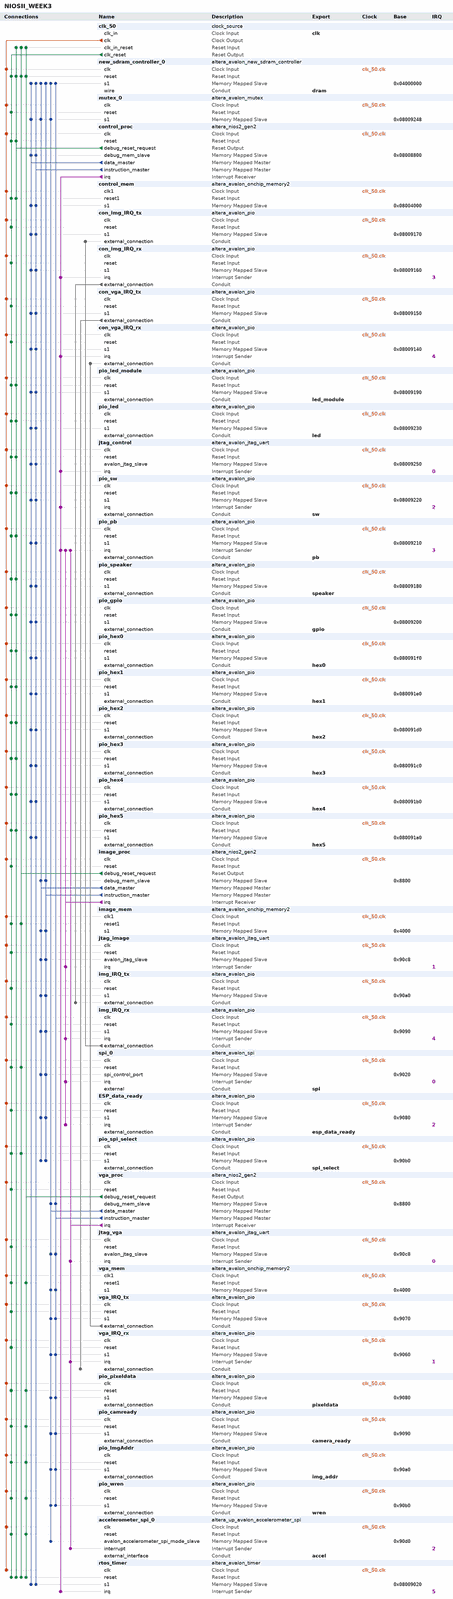
[diagram p0: system contents, whole]
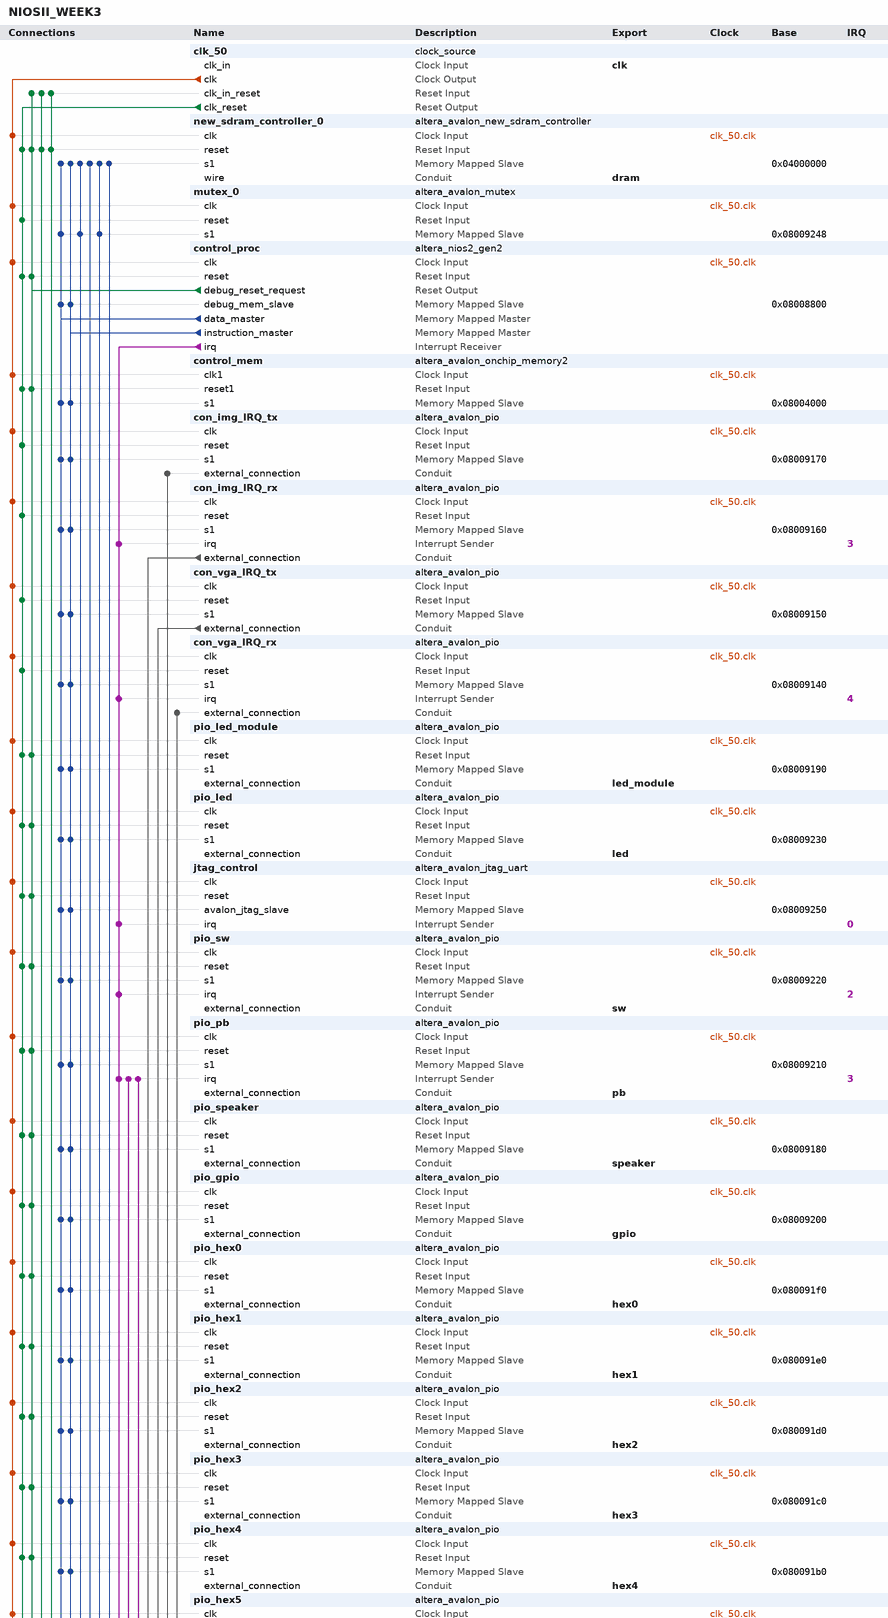
[diagram p1: system contents, upper part]
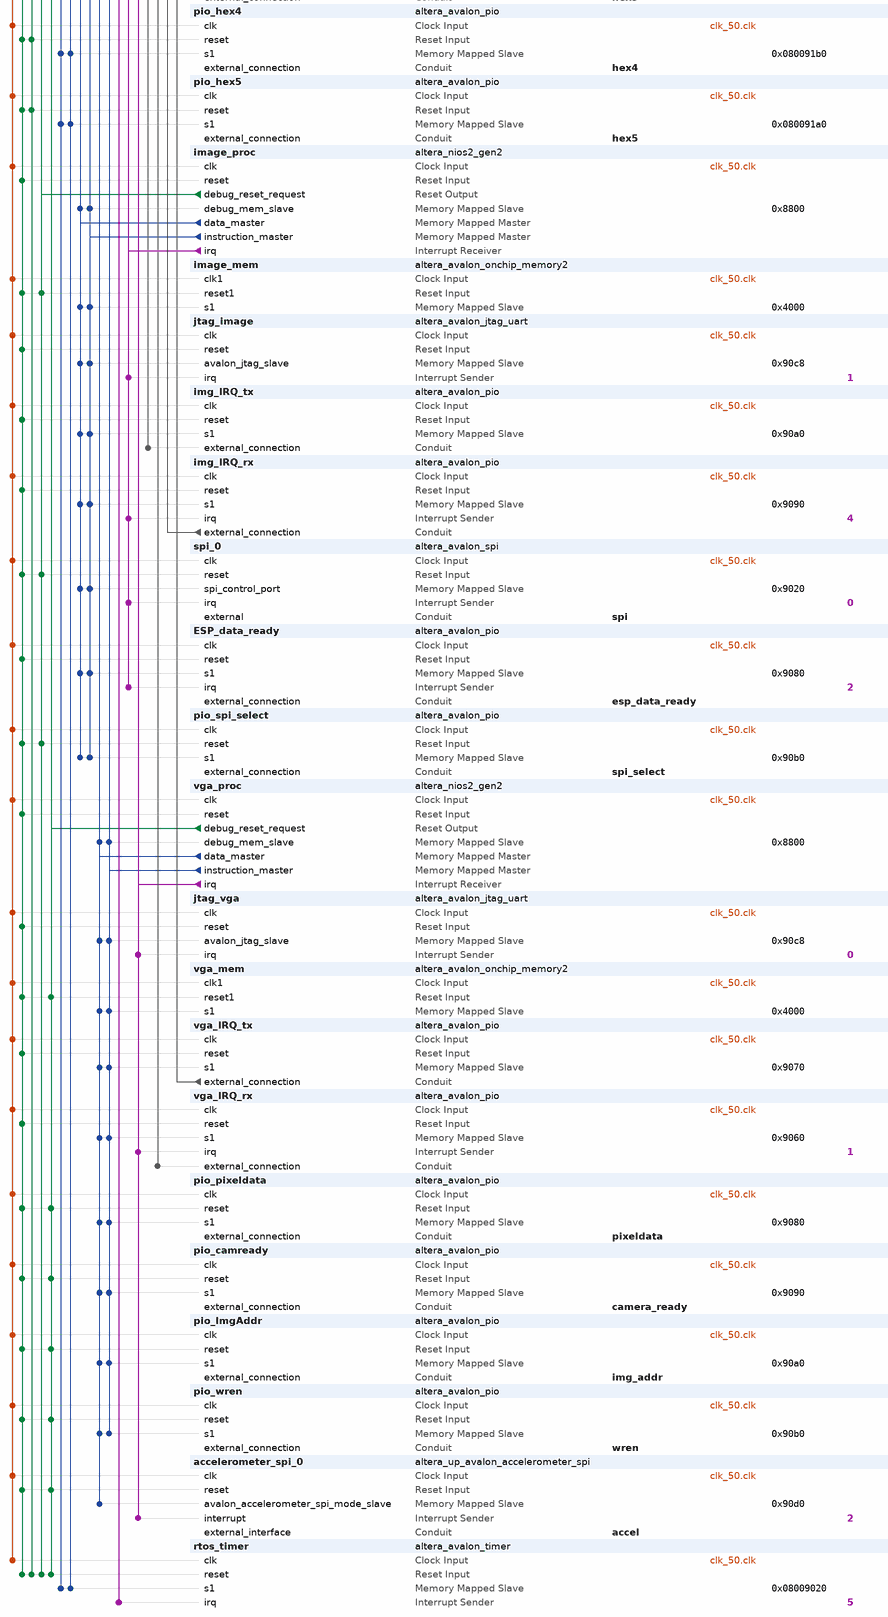
[diagram p2: system contents, lower part]
# Platform Designer (Qsys) system NIOSII_WEEK3, MAX 10 10M50DAF484C7G
# Parameters at their usual value, and those the tool derives, are not listed.
package require -exact qsys 18.1
create_system NIOSII_WEEK3
set_project_property DEVICE_FAMILY {MAX 10}
set_project_property DEVICE 10M50DAF484C7G

add_instance clk_50 clock_source 18.1
set_instance_parameter_value clk_50 clockFrequency 50000000

add_instance new_sdram_controller_0 altera_avalon_new_sdram_controller 18.1
set_instance_parameter_value new_sdram_controller_0 TAC 5.5
set_instance_parameter_value new_sdram_controller_0 TRCD 20.0
set_instance_parameter_value new_sdram_controller_0 TRP 20.0
set_instance_parameter_value new_sdram_controller_0 casLatency 3
set_instance_parameter_value new_sdram_controller_0 columnWidth 10
set_instance_parameter_value new_sdram_controller_0 dataWidth 16
set_instance_parameter_value new_sdram_controller_0 generateSimulationModel false
set_instance_parameter_value new_sdram_controller_0 model single_Micron_MT48LC4M32B2_7_chip
set_instance_parameter_value new_sdram_controller_0 numberOfBanks 4
set_instance_parameter_value new_sdram_controller_0 numberOfChipSelects 1
set_instance_parameter_value new_sdram_controller_0 powerUpDelay 100.0
set_instance_parameter_value new_sdram_controller_0 refreshPeriod 15.625
set_instance_parameter_value new_sdram_controller_0 rowWidth 13

add_instance mutex_0 altera_avalon_mutex 18.1

add_instance control_proc altera_nios2_gen2 18.1
set_instance_parameter_value control_proc dcache_size 2048
set_instance_parameter_value control_proc exceptionSlave control_mem.s1
set_instance_parameter_value control_proc icache_size 4096
set_instance_parameter_value control_proc impl Fast
set_instance_parameter_value control_proc resetSlave control_mem.s1

add_instance control_mem altera_avalon_onchip_memory2 18.1
set_instance_parameter_value control_mem dataWidth 32
set_instance_parameter_value control_mem dualPort false
set_instance_parameter_value control_mem initMemContent false
set_instance_parameter_value control_mem initializationFileName onchip_mem.hex
set_instance_parameter_value control_mem memorySize 16384

add_instance con_img_IRQ_tx altera_avalon_pio 18.1
set_instance_parameter_value con_img_IRQ_tx direction Output
set_instance_parameter_value con_img_IRQ_tx generateIRQ true
set_instance_parameter_value con_img_IRQ_tx width 1

add_instance con_img_IRQ_rx altera_avalon_pio 18.1
set_instance_parameter_value con_img_IRQ_rx captureEdge true
set_instance_parameter_value con_img_IRQ_rx direction Input
set_instance_parameter_value con_img_IRQ_rx generateIRQ true
set_instance_parameter_value con_img_IRQ_rx irqType EDGE
set_instance_parameter_value con_img_IRQ_rx width 1

add_instance con_vga_IRQ_tx altera_avalon_pio 18.1
set_instance_parameter_value con_vga_IRQ_tx direction Output
set_instance_parameter_value con_vga_IRQ_tx generateIRQ true
set_instance_parameter_value con_vga_IRQ_tx width 1

add_instance con_vga_IRQ_rx altera_avalon_pio 18.1
set_instance_parameter_value con_vga_IRQ_rx captureEdge true
set_instance_parameter_value con_vga_IRQ_rx direction Input
set_instance_parameter_value con_vga_IRQ_rx generateIRQ true
set_instance_parameter_value con_vga_IRQ_rx irqType EDGE
set_instance_parameter_value con_vga_IRQ_rx width 1

add_instance pio_led_module altera_avalon_pio 18.1
set_instance_parameter_value pio_led_module direction Output
set_instance_parameter_value pio_led_module width 3

add_instance pio_led altera_avalon_pio 18.1
set_instance_parameter_value pio_led direction Output
set_instance_parameter_value pio_led width 10

add_instance jtag_control altera_avalon_jtag_uart 18.1
set_instance_parameter_value jtag_control simInteractiveOptions NO_INTERACTIVE_WINDOWS

add_instance pio_sw altera_avalon_pio 18.1
set_instance_parameter_value pio_sw captureEdge true
set_instance_parameter_value pio_sw direction Input
set_instance_parameter_value pio_sw edgeType ANY
set_instance_parameter_value pio_sw generateIRQ true
set_instance_parameter_value pio_sw irqType EDGE
set_instance_parameter_value pio_sw width 10

add_instance pio_pb altera_avalon_pio 18.1
set_instance_parameter_value pio_pb captureEdge true
set_instance_parameter_value pio_pb direction Input
set_instance_parameter_value pio_pb edgeType FALLING
set_instance_parameter_value pio_pb generateIRQ true
set_instance_parameter_value pio_pb irqType EDGE
set_instance_parameter_value pio_pb width 2

add_instance pio_speaker altera_avalon_pio 18.1
set_instance_parameter_value pio_speaker direction Output
set_instance_parameter_value pio_speaker width 1

add_instance pio_gpio altera_avalon_pio 18.1
set_instance_parameter_value pio_gpio direction Output
set_instance_parameter_value pio_gpio width 2

add_instance pio_hex0 altera_avalon_pio 18.1
set_instance_parameter_value pio_hex0 direction Output
set_instance_parameter_value pio_hex0 width 8

add_instance pio_hex1 altera_avalon_pio 18.1
set_instance_parameter_value pio_hex1 direction Output
set_instance_parameter_value pio_hex1 width 8

add_instance pio_hex2 altera_avalon_pio 18.1
set_instance_parameter_value pio_hex2 direction Output
set_instance_parameter_value pio_hex2 width 8

add_instance pio_hex3 altera_avalon_pio 18.1
set_instance_parameter_value pio_hex3 direction Output
set_instance_parameter_value pio_hex3 width 8

add_instance pio_hex4 altera_avalon_pio 18.1
set_instance_parameter_value pio_hex4 direction Output
set_instance_parameter_value pio_hex4 width 8

add_instance pio_hex5 altera_avalon_pio 18.1
set_instance_parameter_value pio_hex5 direction Output
set_instance_parameter_value pio_hex5 width 8

add_instance image_proc altera_nios2_gen2 18.1
set_instance_parameter_value image_proc dcache_size 2048
set_instance_parameter_value image_proc exceptionSlave image_mem.s1
set_instance_parameter_value image_proc icache_size 4096
set_instance_parameter_value image_proc impl Fast
set_instance_parameter_value image_proc resetSlave image_mem.s1

add_instance image_mem altera_avalon_onchip_memory2 18.1
set_instance_parameter_value image_mem dataWidth 32
set_instance_parameter_value image_mem dualPort false
set_instance_parameter_value image_mem initMemContent false
set_instance_parameter_value image_mem initializationFileName onchip_mem.hex
set_instance_parameter_value image_mem memorySize 16384

add_instance jtag_image altera_avalon_jtag_uart 18.1
set_instance_parameter_value jtag_image simInteractiveOptions NO_INTERACTIVE_WINDOWS

add_instance img_IRQ_tx altera_avalon_pio 18.1
set_instance_parameter_value img_IRQ_tx direction Output
set_instance_parameter_value img_IRQ_tx generateIRQ true
set_instance_parameter_value img_IRQ_tx width 1

add_instance img_IRQ_rx altera_avalon_pio 18.1
set_instance_parameter_value img_IRQ_rx captureEdge true
set_instance_parameter_value img_IRQ_rx direction Input
set_instance_parameter_value img_IRQ_rx generateIRQ true
set_instance_parameter_value img_IRQ_rx irqType EDGE
set_instance_parameter_value img_IRQ_rx width 1

add_instance spi_0 altera_avalon_spi 18.1
set_instance_parameter_value spi_0 clockPolarity 0
set_instance_parameter_value spi_0 dataWidth 8
set_instance_parameter_value spi_0 masterSPI true
set_instance_parameter_value spi_0 numberOfSlaves 1
set_instance_parameter_value spi_0 targetClockRate 128000

add_instance ESP_data_ready altera_avalon_pio 18.1
set_instance_parameter_value ESP_data_ready captureEdge true
set_instance_parameter_value ESP_data_ready direction Input
set_instance_parameter_value ESP_data_ready generateIRQ true
set_instance_parameter_value ESP_data_ready irqType EDGE
set_instance_parameter_value ESP_data_ready width 1

add_instance pio_spi_select altera_avalon_pio 18.1
set_instance_parameter_value pio_spi_select direction Input
set_instance_parameter_value pio_spi_select width 1

add_instance vga_proc altera_nios2_gen2 18.1
set_instance_parameter_value vga_proc dcache_size 2048
set_instance_parameter_value vga_proc exceptionSlave vga_mem.s1
set_instance_parameter_value vga_proc icache_size 4096
set_instance_parameter_value vga_proc impl Fast
set_instance_parameter_value vga_proc resetSlave vga_mem.s1

add_instance jtag_vga altera_avalon_jtag_uart 18.1
set_instance_parameter_value jtag_vga simInteractiveOptions NO_INTERACTIVE_WINDOWS

add_instance vga_mem altera_avalon_onchip_memory2 18.1
set_instance_parameter_value vga_mem dataWidth 32
set_instance_parameter_value vga_mem dualPort false
set_instance_parameter_value vga_mem initMemContent false
set_instance_parameter_value vga_mem initializationFileName onchip_mem.hex
set_instance_parameter_value vga_mem memorySize 16384

add_instance vga_IRQ_tx altera_avalon_pio 18.1
set_instance_parameter_value vga_IRQ_tx direction Output
set_instance_parameter_value vga_IRQ_tx generateIRQ true
set_instance_parameter_value vga_IRQ_tx width 1

add_instance vga_IRQ_rx altera_avalon_pio 18.1
set_instance_parameter_value vga_IRQ_rx captureEdge true
set_instance_parameter_value vga_IRQ_rx direction Input
set_instance_parameter_value vga_IRQ_rx generateIRQ true
set_instance_parameter_value vga_IRQ_rx irqType EDGE
set_instance_parameter_value vga_IRQ_rx width 1

add_instance pio_pixeldata altera_avalon_pio 18.1
set_instance_parameter_value pio_pixeldata direction Output
set_instance_parameter_value pio_pixeldata width 8

add_instance pio_camready altera_avalon_pio 18.1
set_instance_parameter_value pio_camready direction Input
set_instance_parameter_value pio_camready width 1

add_instance pio_ImgAddr altera_avalon_pio 18.1
set_instance_parameter_value pio_ImgAddr direction Output
set_instance_parameter_value pio_ImgAddr width 17

add_instance pio_wren altera_avalon_pio 18.1
set_instance_parameter_value pio_wren direction Output
set_instance_parameter_value pio_wren width 1

add_instance accelerometer_spi_0 altera_up_avalon_accelerometer_spi 18.0

add_instance rtos_timer altera_avalon_timer 18.1
set_instance_parameter_value rtos_timer period 0.1
set_instance_parameter_value rtos_timer periodUnits MSEC

# connections
add_connection clk_50.clk accelerometer_spi_0.clk clock
add_connection clk_50.clk con_img_IRQ_rx.clk clock
add_connection clk_50.clk con_img_IRQ_tx.clk clock
add_connection clk_50.clk con_vga_IRQ_rx.clk clock
add_connection clk_50.clk con_vga_IRQ_tx.clk clock
add_connection clk_50.clk control_mem.clk1 clock
add_connection clk_50.clk control_proc.clk clock
add_connection clk_50.clk ESP_data_ready.clk clock
add_connection clk_50.clk image_mem.clk1 clock
add_connection clk_50.clk image_proc.clk clock
add_connection clk_50.clk img_IRQ_rx.clk clock
add_connection clk_50.clk img_IRQ_tx.clk clock
add_connection clk_50.clk jtag_control.clk clock
add_connection clk_50.clk jtag_image.clk clock
add_connection clk_50.clk jtag_vga.clk clock
add_connection clk_50.clk mutex_0.clk clock
add_connection clk_50.clk new_sdram_controller_0.clk clock
add_connection clk_50.clk pio_camready.clk clock
add_connection clk_50.clk pio_gpio.clk clock
add_connection clk_50.clk pio_hex0.clk clock
add_connection clk_50.clk pio_hex1.clk clock
add_connection clk_50.clk pio_hex2.clk clock
add_connection clk_50.clk pio_hex3.clk clock
add_connection clk_50.clk pio_hex4.clk clock
add_connection clk_50.clk pio_hex5.clk clock
add_connection clk_50.clk pio_ImgAddr.clk clock
add_connection clk_50.clk pio_led.clk clock
add_connection clk_50.clk pio_led_module.clk clock
add_connection clk_50.clk pio_pb.clk clock
add_connection clk_50.clk pio_pixeldata.clk clock
add_connection clk_50.clk pio_speaker.clk clock
add_connection clk_50.clk pio_spi_select.clk clock
add_connection clk_50.clk pio_sw.clk clock
add_connection clk_50.clk pio_wren.clk clock
add_connection clk_50.clk rtos_timer.clk clock
add_connection clk_50.clk spi_0.clk clock
add_connection clk_50.clk vga_IRQ_rx.clk clock
add_connection clk_50.clk vga_IRQ_tx.clk clock
add_connection clk_50.clk vga_mem.clk1 clock
add_connection clk_50.clk vga_proc.clk clock
add_connection clk_50.clk_reset accelerometer_spi_0.reset reset
add_connection clk_50.clk_reset con_img_IRQ_rx.reset reset
add_connection clk_50.clk_reset con_img_IRQ_tx.reset reset
add_connection clk_50.clk_reset con_vga_IRQ_rx.reset reset
add_connection clk_50.clk_reset con_vga_IRQ_tx.reset reset
add_connection clk_50.clk_reset control_mem.reset1 reset
add_connection clk_50.clk_reset control_proc.reset reset
add_connection clk_50.clk_reset ESP_data_ready.reset reset
add_connection clk_50.clk_reset image_mem.reset1 reset
add_connection clk_50.clk_reset image_proc.reset reset
add_connection clk_50.clk_reset img_IRQ_rx.reset reset
add_connection clk_50.clk_reset img_IRQ_tx.reset reset
add_connection clk_50.clk_reset jtag_control.reset reset
add_connection clk_50.clk_reset jtag_image.reset reset
add_connection clk_50.clk_reset jtag_vga.reset reset
add_connection clk_50.clk_reset mutex_0.reset reset
add_connection clk_50.clk_reset new_sdram_controller_0.reset reset
add_connection clk_50.clk_reset pio_camready.reset reset
add_connection clk_50.clk_reset pio_gpio.reset reset
add_connection clk_50.clk_reset pio_hex0.reset reset
add_connection clk_50.clk_reset pio_hex1.reset reset
add_connection clk_50.clk_reset pio_hex2.reset reset
add_connection clk_50.clk_reset pio_hex3.reset reset
add_connection clk_50.clk_reset pio_hex4.reset reset
add_connection clk_50.clk_reset pio_hex5.reset reset
add_connection clk_50.clk_reset pio_ImgAddr.reset reset
add_connection clk_50.clk_reset pio_led.reset reset
add_connection clk_50.clk_reset pio_led_module.reset reset
add_connection clk_50.clk_reset pio_pb.reset reset
add_connection clk_50.clk_reset pio_pixeldata.reset reset
add_connection clk_50.clk_reset pio_speaker.reset reset
add_connection clk_50.clk_reset pio_spi_select.reset reset
add_connection clk_50.clk_reset pio_sw.reset reset
add_connection clk_50.clk_reset pio_wren.reset reset
add_connection clk_50.clk_reset rtos_timer.reset reset
add_connection clk_50.clk_reset spi_0.reset reset
add_connection clk_50.clk_reset vga_IRQ_rx.reset reset
add_connection clk_50.clk_reset vga_IRQ_tx.reset reset
add_connection clk_50.clk_reset vga_mem.reset1 reset
add_connection clk_50.clk_reset vga_proc.reset reset
add_connection control_proc.debug_reset_request clk_50.clk_in_reset reset
add_connection control_proc.debug_reset_request control_mem.reset1 reset
add_connection control_proc.debug_reset_request control_proc.reset reset
add_connection control_proc.debug_reset_request jtag_control.reset reset
add_connection control_proc.debug_reset_request new_sdram_controller_0.reset reset
add_connection control_proc.debug_reset_request pio_gpio.reset reset
add_connection control_proc.debug_reset_request pio_hex0.reset reset
add_connection control_proc.debug_reset_request pio_hex1.reset reset
add_connection control_proc.debug_reset_request pio_hex2.reset reset
add_connection control_proc.debug_reset_request pio_hex3.reset reset
add_connection control_proc.debug_reset_request pio_hex4.reset reset
add_connection control_proc.debug_reset_request pio_hex5.reset reset
add_connection control_proc.debug_reset_request pio_led.reset reset
add_connection control_proc.debug_reset_request pio_led_module.reset reset
add_connection control_proc.debug_reset_request pio_pb.reset reset
add_connection control_proc.debug_reset_request pio_speaker.reset reset
add_connection control_proc.debug_reset_request pio_sw.reset reset
add_connection control_proc.debug_reset_request rtos_timer.reset reset
add_connection image_proc.debug_reset_request clk_50.clk_in_reset reset
add_connection image_proc.debug_reset_request image_mem.reset1 reset
add_connection image_proc.debug_reset_request new_sdram_controller_0.reset reset
add_connection image_proc.debug_reset_request pio_spi_select.reset reset
add_connection image_proc.debug_reset_request rtos_timer.reset reset
add_connection image_proc.debug_reset_request spi_0.reset reset
add_connection vga_proc.debug_reset_request accelerometer_spi_0.reset reset
add_connection vga_proc.debug_reset_request clk_50.clk_in_reset reset
add_connection vga_proc.debug_reset_request new_sdram_controller_0.reset reset
add_connection vga_proc.debug_reset_request pio_camready.reset reset
add_connection vga_proc.debug_reset_request pio_ImgAddr.reset reset
add_connection vga_proc.debug_reset_request pio_pixeldata.reset reset
add_connection vga_proc.debug_reset_request pio_wren.reset reset
add_connection vga_proc.debug_reset_request rtos_timer.reset reset
add_connection vga_proc.debug_reset_request vga_mem.reset1 reset
add_connection control_proc.data_master con_img_IRQ_rx.s1 avalon
set_connection_parameter_value control_proc.data_master/con_img_IRQ_rx.s1 baseAddress 0x08009160
add_connection control_proc.data_master con_img_IRQ_tx.s1 avalon
set_connection_parameter_value control_proc.data_master/con_img_IRQ_tx.s1 baseAddress 0x08009170
add_connection control_proc.data_master con_vga_IRQ_rx.s1 avalon
set_connection_parameter_value control_proc.data_master/con_vga_IRQ_rx.s1 baseAddress 0x08009140
add_connection control_proc.data_master con_vga_IRQ_tx.s1 avalon
set_connection_parameter_value control_proc.data_master/con_vga_IRQ_tx.s1 baseAddress 0x08009150
add_connection control_proc.data_master control_mem.s1 avalon
set_connection_parameter_value control_proc.data_master/control_mem.s1 baseAddress 0x08004000
add_connection control_proc.data_master control_proc.debug_mem_slave avalon
set_connection_parameter_value control_proc.data_master/control_proc.debug_mem_slave baseAddress 0x08008800
add_connection control_proc.data_master jtag_control.avalon_jtag_slave avalon
set_connection_parameter_value control_proc.data_master/jtag_control.avalon_jtag_slave baseAddress 0x08009250
add_connection control_proc.data_master mutex_0.s1 avalon
set_connection_parameter_value control_proc.data_master/mutex_0.s1 baseAddress 0x08009248
add_connection control_proc.data_master new_sdram_controller_0.s1 avalon
set_connection_parameter_value control_proc.data_master/new_sdram_controller_0.s1 baseAddress 0x04000000
add_connection control_proc.data_master pio_gpio.s1 avalon
set_connection_parameter_value control_proc.data_master/pio_gpio.s1 baseAddress 0x08009200
add_connection control_proc.data_master pio_hex0.s1 avalon
set_connection_parameter_value control_proc.data_master/pio_hex0.s1 baseAddress 0x080091f0
add_connection control_proc.data_master pio_hex1.s1 avalon
set_connection_parameter_value control_proc.data_master/pio_hex1.s1 baseAddress 0x080091e0
add_connection control_proc.data_master pio_hex2.s1 avalon
set_connection_parameter_value control_proc.data_master/pio_hex2.s1 baseAddress 0x080091d0
add_connection control_proc.data_master pio_hex3.s1 avalon
set_connection_parameter_value control_proc.data_master/pio_hex3.s1 baseAddress 0x080091c0
add_connection control_proc.data_master pio_hex4.s1 avalon
set_connection_parameter_value control_proc.data_master/pio_hex4.s1 baseAddress 0x080091b0
add_connection control_proc.data_master pio_hex5.s1 avalon
set_connection_parameter_value control_proc.data_master/pio_hex5.s1 baseAddress 0x080091a0
add_connection control_proc.data_master pio_led.s1 avalon
set_connection_parameter_value control_proc.data_master/pio_led.s1 baseAddress 0x08009230
add_connection control_proc.data_master pio_led_module.s1 avalon
set_connection_parameter_value control_proc.data_master/pio_led_module.s1 baseAddress 0x08009190
add_connection control_proc.data_master pio_pb.s1 avalon
set_connection_parameter_value control_proc.data_master/pio_pb.s1 baseAddress 0x08009210
add_connection control_proc.data_master pio_speaker.s1 avalon
set_connection_parameter_value control_proc.data_master/pio_speaker.s1 baseAddress 0x08009180
add_connection control_proc.data_master pio_sw.s1 avalon
set_connection_parameter_value control_proc.data_master/pio_sw.s1 baseAddress 0x08009220
add_connection control_proc.data_master rtos_timer.s1 avalon
set_connection_parameter_value control_proc.data_master/rtos_timer.s1 baseAddress 0x08009020
add_connection control_proc.instruction_master con_img_IRQ_rx.s1 avalon
set_connection_parameter_value control_proc.instruction_master/con_img_IRQ_rx.s1 baseAddress 0x08009160
add_connection control_proc.instruction_master con_img_IRQ_tx.s1 avalon
set_connection_parameter_value control_proc.instruction_master/con_img_IRQ_tx.s1 baseAddress 0x08009170
add_connection control_proc.instruction_master con_vga_IRQ_rx.s1 avalon
set_connection_parameter_value control_proc.instruction_master/con_vga_IRQ_rx.s1 baseAddress 0x08009140
add_connection control_proc.instruction_master con_vga_IRQ_tx.s1 avalon
set_connection_parameter_value control_proc.instruction_master/con_vga_IRQ_tx.s1 baseAddress 0x08009150
add_connection control_proc.instruction_master control_mem.s1 avalon
set_connection_parameter_value control_proc.instruction_master/control_mem.s1 baseAddress 0x08004000
add_connection control_proc.instruction_master control_proc.debug_mem_slave avalon
set_connection_parameter_value control_proc.instruction_master/control_proc.debug_mem_slave baseAddress 0x08008800
add_connection control_proc.instruction_master jtag_control.avalon_jtag_slave avalon
set_connection_parameter_value control_proc.instruction_master/jtag_control.avalon_jtag_slave baseAddress 0x08009250
add_connection control_proc.instruction_master new_sdram_controller_0.s1 avalon
set_connection_parameter_value control_proc.instruction_master/new_sdram_controller_0.s1 baseAddress 0x04000000
add_connection control_proc.instruction_master pio_gpio.s1 avalon
set_connection_parameter_value control_proc.instruction_master/pio_gpio.s1 baseAddress 0x08009200
add_connection control_proc.instruction_master pio_hex0.s1 avalon
set_connection_parameter_value control_proc.instruction_master/pio_hex0.s1 baseAddress 0x080091f0
add_connection control_proc.instruction_master pio_hex1.s1 avalon
set_connection_parameter_value control_proc.instruction_master/pio_hex1.s1 baseAddress 0x080091e0
add_connection control_proc.instruction_master pio_hex2.s1 avalon
set_connection_parameter_value control_proc.instruction_master/pio_hex2.s1 baseAddress 0x080091d0
add_connection control_proc.instruction_master pio_hex3.s1 avalon
set_connection_parameter_value control_proc.instruction_master/pio_hex3.s1 baseAddress 0x080091c0
add_connection control_proc.instruction_master pio_hex4.s1 avalon
set_connection_parameter_value control_proc.instruction_master/pio_hex4.s1 baseAddress 0x080091b0
add_connection control_proc.instruction_master pio_hex5.s1 avalon
set_connection_parameter_value control_proc.instruction_master/pio_hex5.s1 baseAddress 0x080091a0
add_connection control_proc.instruction_master pio_led.s1 avalon
set_connection_parameter_value control_proc.instruction_master/pio_led.s1 baseAddress 0x08009230
add_connection control_proc.instruction_master pio_led_module.s1 avalon
set_connection_parameter_value control_proc.instruction_master/pio_led_module.s1 baseAddress 0x08009190
add_connection control_proc.instruction_master pio_pb.s1 avalon
set_connection_parameter_value control_proc.instruction_master/pio_pb.s1 baseAddress 0x08009210
add_connection control_proc.instruction_master pio_speaker.s1 avalon
set_connection_parameter_value control_proc.instruction_master/pio_speaker.s1 baseAddress 0x08009180
add_connection control_proc.instruction_master pio_sw.s1 avalon
set_connection_parameter_value control_proc.instruction_master/pio_sw.s1 baseAddress 0x08009220
add_connection control_proc.instruction_master rtos_timer.s1 avalon
set_connection_parameter_value control_proc.instruction_master/rtos_timer.s1 baseAddress 0x08009020
add_connection image_proc.data_master ESP_data_ready.s1 avalon
set_connection_parameter_value image_proc.data_master/ESP_data_ready.s1 baseAddress 0x9080
add_connection image_proc.data_master image_mem.s1 avalon
set_connection_parameter_value image_proc.data_master/image_mem.s1 baseAddress 0x4000
add_connection image_proc.data_master image_proc.debug_mem_slave avalon
set_connection_parameter_value image_proc.data_master/image_proc.debug_mem_slave baseAddress 0x8800
add_connection image_proc.data_master img_IRQ_rx.s1 avalon
set_connection_parameter_value image_proc.data_master/img_IRQ_rx.s1 baseAddress 0x9090
add_connection image_proc.data_master img_IRQ_tx.s1 avalon
set_connection_parameter_value image_proc.data_master/img_IRQ_tx.s1 baseAddress 0x90a0
add_connection image_proc.data_master jtag_image.avalon_jtag_slave avalon
set_connection_parameter_value image_proc.data_master/jtag_image.avalon_jtag_slave baseAddress 0x90c8
add_connection image_proc.data_master mutex_0.s1 avalon
set_connection_parameter_value image_proc.data_master/mutex_0.s1 baseAddress 0x08009248
add_connection image_proc.data_master new_sdram_controller_0.s1 avalon
set_connection_parameter_value image_proc.data_master/new_sdram_controller_0.s1 baseAddress 0x04000000
add_connection image_proc.data_master pio_spi_select.s1 avalon
set_connection_parameter_value image_proc.data_master/pio_spi_select.s1 baseAddress 0x90b0
add_connection image_proc.data_master spi_0.spi_control_port avalon
set_connection_parameter_value image_proc.data_master/spi_0.spi_control_port baseAddress 0x9020
add_connection image_proc.instruction_master ESP_data_ready.s1 avalon
set_connection_parameter_value image_proc.instruction_master/ESP_data_ready.s1 baseAddress 0x9080
add_connection image_proc.instruction_master image_mem.s1 avalon
set_connection_parameter_value image_proc.instruction_master/image_mem.s1 baseAddress 0x4000
add_connection image_proc.instruction_master image_proc.debug_mem_slave avalon
set_connection_parameter_value image_proc.instruction_master/image_proc.debug_mem_slave baseAddress 0x8800
add_connection image_proc.instruction_master img_IRQ_rx.s1 avalon
set_connection_parameter_value image_proc.instruction_master/img_IRQ_rx.s1 baseAddress 0x9090
add_connection image_proc.instruction_master img_IRQ_tx.s1 avalon
set_connection_parameter_value image_proc.instruction_master/img_IRQ_tx.s1 baseAddress 0x90a0
add_connection image_proc.instruction_master jtag_image.avalon_jtag_slave avalon
set_connection_parameter_value image_proc.instruction_master/jtag_image.avalon_jtag_slave baseAddress 0x90c8
add_connection image_proc.instruction_master new_sdram_controller_0.s1 avalon
set_connection_parameter_value image_proc.instruction_master/new_sdram_controller_0.s1 baseAddress 0x04000000
add_connection image_proc.instruction_master pio_spi_select.s1 avalon
set_connection_parameter_value image_proc.instruction_master/pio_spi_select.s1 baseAddress 0x90b0
add_connection image_proc.instruction_master spi_0.spi_control_port avalon
set_connection_parameter_value image_proc.instruction_master/spi_0.spi_control_port baseAddress 0x9020
add_connection vga_proc.data_master accelerometer_spi_0.avalon_accelerometer_spi_mode_slave avalon
set_connection_parameter_value vga_proc.data_master/accelerometer_spi_0.avalon_accelerometer_spi_mode_slave baseAddress 0x90d0
add_connection vga_proc.data_master jtag_vga.avalon_jtag_slave avalon
set_connection_parameter_value vga_proc.data_master/jtag_vga.avalon_jtag_slave baseAddress 0x90c8
add_connection vga_proc.data_master mutex_0.s1 avalon
set_connection_parameter_value vga_proc.data_master/mutex_0.s1 baseAddress 0x08009248
add_connection vga_proc.data_master new_sdram_controller_0.s1 avalon
set_connection_parameter_value vga_proc.data_master/new_sdram_controller_0.s1 baseAddress 0x04000000
add_connection vga_proc.data_master pio_camready.s1 avalon
set_connection_parameter_value vga_proc.data_master/pio_camready.s1 baseAddress 0x9090
add_connection vga_proc.data_master pio_ImgAddr.s1 avalon
set_connection_parameter_value vga_proc.data_master/pio_ImgAddr.s1 baseAddress 0x90a0
add_connection vga_proc.data_master pio_pixeldata.s1 avalon
set_connection_parameter_value vga_proc.data_master/pio_pixeldata.s1 baseAddress 0x9080
add_connection vga_proc.data_master pio_wren.s1 avalon
set_connection_parameter_value vga_proc.data_master/pio_wren.s1 baseAddress 0x90b0
add_connection vga_proc.data_master vga_IRQ_rx.s1 avalon
set_connection_parameter_value vga_proc.data_master/vga_IRQ_rx.s1 baseAddress 0x9060
add_connection vga_proc.data_master vga_IRQ_tx.s1 avalon
set_connection_parameter_value vga_proc.data_master/vga_IRQ_tx.s1 baseAddress 0x9070
add_connection vga_proc.data_master vga_mem.s1 avalon
set_connection_parameter_value vga_proc.data_master/vga_mem.s1 baseAddress 0x4000
add_connection vga_proc.data_master vga_proc.debug_mem_slave avalon
set_connection_parameter_value vga_proc.data_master/vga_proc.debug_mem_slave baseAddress 0x8800
add_connection vga_proc.instruction_master jtag_vga.avalon_jtag_slave avalon
set_connection_parameter_value vga_proc.instruction_master/jtag_vga.avalon_jtag_slave baseAddress 0x90c8
add_connection vga_proc.instruction_master new_sdram_controller_0.s1 avalon
set_connection_parameter_value vga_proc.instruction_master/new_sdram_controller_0.s1 baseAddress 0x04000000
add_connection vga_proc.instruction_master pio_camready.s1 avalon
set_connection_parameter_value vga_proc.instruction_master/pio_camready.s1 baseAddress 0x9090
add_connection vga_proc.instruction_master pio_ImgAddr.s1 avalon
set_connection_parameter_value vga_proc.instruction_master/pio_ImgAddr.s1 baseAddress 0x90a0
add_connection vga_proc.instruction_master pio_pixeldata.s1 avalon
set_connection_parameter_value vga_proc.instruction_master/pio_pixeldata.s1 baseAddress 0x9080
add_connection vga_proc.instruction_master pio_wren.s1 avalon
set_connection_parameter_value vga_proc.instruction_master/pio_wren.s1 baseAddress 0x90b0
add_connection vga_proc.instruction_master vga_IRQ_rx.s1 avalon
set_connection_parameter_value vga_proc.instruction_master/vga_IRQ_rx.s1 baseAddress 0x9060
add_connection vga_proc.instruction_master vga_IRQ_tx.s1 avalon
set_connection_parameter_value vga_proc.instruction_master/vga_IRQ_tx.s1 baseAddress 0x9070
add_connection vga_proc.instruction_master vga_mem.s1 avalon
set_connection_parameter_value vga_proc.instruction_master/vga_mem.s1 baseAddress 0x4000
add_connection vga_proc.instruction_master vga_proc.debug_mem_slave avalon
set_connection_parameter_value vga_proc.instruction_master/vga_proc.debug_mem_slave baseAddress 0x8800
add_connection con_img_IRQ_rx.external_connection img_IRQ_tx.external_connection conduit
add_connection con_vga_IRQ_tx.external_connection vga_IRQ_rx.external_connection conduit
add_connection img_IRQ_rx.external_connection con_img_IRQ_tx.external_connection conduit
add_connection vga_IRQ_tx.external_connection con_vga_IRQ_rx.external_connection conduit
add_connection control_proc.irq con_img_IRQ_rx.irq interrupt
set_connection_parameter_value control_proc.irq/con_img_IRQ_rx.irq irqNumber 3
add_connection control_proc.irq con_vga_IRQ_rx.irq interrupt
set_connection_parameter_value control_proc.irq/con_vga_IRQ_rx.irq irqNumber 4
add_connection control_proc.irq jtag_control.irq interrupt
set_connection_parameter_value control_proc.irq/jtag_control.irq irqNumber 0
add_connection control_proc.irq pio_pb.irq interrupt
set_connection_parameter_value control_proc.irq/pio_pb.irq irqNumber 1
add_connection control_proc.irq pio_sw.irq interrupt
set_connection_parameter_value control_proc.irq/pio_sw.irq irqNumber 2
add_connection control_proc.irq rtos_timer.irq interrupt
set_connection_parameter_value control_proc.irq/rtos_timer.irq irqNumber 5
add_connection image_proc.irq ESP_data_ready.irq interrupt
set_connection_parameter_value image_proc.irq/ESP_data_ready.irq irqNumber 2
add_connection image_proc.irq img_IRQ_rx.irq interrupt
set_connection_parameter_value image_proc.irq/img_IRQ_rx.irq irqNumber 4
add_connection image_proc.irq jtag_image.irq interrupt
set_connection_parameter_value image_proc.irq/jtag_image.irq irqNumber 1
add_connection image_proc.irq pio_pb.irq interrupt
set_connection_parameter_value image_proc.irq/pio_pb.irq irqNumber 3
add_connection image_proc.irq spi_0.irq interrupt
set_connection_parameter_value image_proc.irq/spi_0.irq irqNumber 0
add_connection vga_proc.irq accelerometer_spi_0.interrupt interrupt
set_connection_parameter_value vga_proc.irq/accelerometer_spi_0.interrupt irqNumber 2
add_connection vga_proc.irq jtag_vga.irq interrupt
set_connection_parameter_value vga_proc.irq/jtag_vga.irq irqNumber 0
add_connection vga_proc.irq pio_pb.irq interrupt
set_connection_parameter_value vga_proc.irq/pio_pb.irq irqNumber 3
add_connection vga_proc.irq vga_IRQ_rx.irq interrupt
set_connection_parameter_value vga_proc.irq/vga_IRQ_rx.irq irqNumber 1

# exported interfaces
add_interface accel conduit end
set_interface_property accel EXPORT_OF accelerometer_spi_0.external_interface
add_interface camera_ready conduit end
set_interface_property camera_ready EXPORT_OF pio_camready.external_connection
add_interface clk clock sink
set_interface_property clk EXPORT_OF clk_50.clk_in
add_interface dram conduit end
set_interface_property dram EXPORT_OF new_sdram_controller_0.wire
add_interface esp_data_ready conduit end
set_interface_property esp_data_ready EXPORT_OF ESP_data_ready.external_connection
add_interface gpio conduit end
set_interface_property gpio EXPORT_OF pio_gpio.external_connection
add_interface hex0 conduit end
set_interface_property hex0 EXPORT_OF pio_hex0.external_connection
add_interface hex1 conduit end
set_interface_property hex1 EXPORT_OF pio_hex1.external_connection
add_interface hex2 conduit end
set_interface_property hex2 EXPORT_OF pio_hex2.external_connection
add_interface hex3 conduit end
set_interface_property hex3 EXPORT_OF pio_hex3.external_connection
add_interface hex4 conduit end
set_interface_property hex4 EXPORT_OF pio_hex4.external_connection
add_interface hex5 conduit end
set_interface_property hex5 EXPORT_OF pio_hex5.external_connection
add_interface img_addr conduit end
set_interface_property img_addr EXPORT_OF pio_ImgAddr.external_connection
add_interface led conduit end
set_interface_property led EXPORT_OF pio_led.external_connection
add_interface led_module conduit end
set_interface_property led_module EXPORT_OF pio_led_module.external_connection
add_interface pb conduit end
set_interface_property pb EXPORT_OF pio_pb.external_connection
add_interface pixeldata conduit end
set_interface_property pixeldata EXPORT_OF pio_pixeldata.external_connection
add_interface speaker conduit end
set_interface_property speaker EXPORT_OF pio_speaker.external_connection
add_interface spi conduit end
set_interface_property spi EXPORT_OF spi_0.external
add_interface spi_select conduit end
set_interface_property spi_select EXPORT_OF pio_spi_select.external_connection
add_interface sw conduit end
set_interface_property sw EXPORT_OF pio_sw.external_connection
add_interface wren conduit end
set_interface_property wren EXPORT_OF pio_wren.external_connection

set_interconnect_requirement {$system} qsys_mm.clockCrossingAdapter HANDSHAKE
set_interconnect_requirement {$system} qsys_mm.enableEccProtection FALSE
set_interconnect_requirement {$system} qsys_mm.insertDefaultSlave FALSE
set_interconnect_requirement {$system} qsys_mm.maxAdditionalLatency 1

save_system NIOSII_WEEK3.qsys
